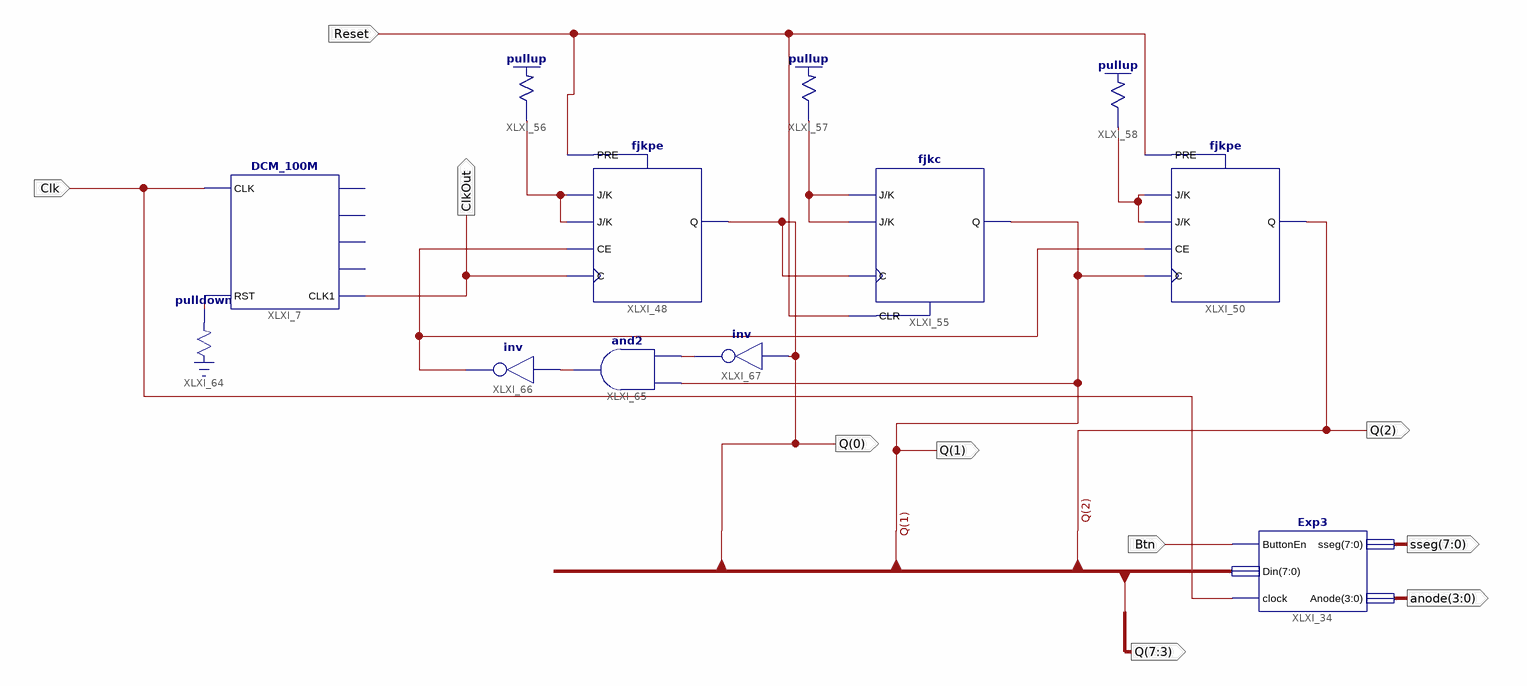
[diagram p0: schematic sheet 1]
// Xilinx ISE schematic Exp4JKOneShotCounter.sch (spartan3e) as structural Verilog: 12 symbols, 10 ports
module Exp4JKOneShotCounter (
  input  Btn,
  input  Reset,
  input  Clk,
  output [7:0] sseg,
  output [3:0] anode,
  output [7:0] Q,
  output ClkOut
);

  wire XLXN_74, XLXN_76, XLXN_112, XLXN_120, XLXN_121, XLXN_123, XLXN_129;

  Exp3 XLXI_34 (.ButtonEn(Btn), .Din(Q), .clock(Clk), .sseg(sseg), .Anode(anode));
  DCM_100M XLXI_7 (.CLK(Clk), .RST(XLXN_112), .CLK1(ClkOut));  // open: CLK1M, CLK10k, CLK1k, CLK100
  fjkpe XLXI_48 (.C(ClkOut), .CE(XLXN_120), .J(XLXN_74), .K(XLXN_74), .PRE(Reset), .Q(Q[0]));
  fjkpe XLXI_50 (.C(Q[1]), .CE(XLXN_120), .J(XLXN_76), .K(XLXN_76), .PRE(Reset), .Q(Q[2]));
  fjkc XLXI_55 (.C(Q[0]), .CLR(Reset), .J(XLXN_129), .K(XLXN_129), .Q(Q[1]));
  \pullup  XLXI_56 (.O(XLXN_74));
  \pullup  XLXI_57 (.O(XLXN_129));
  \pullup  XLXI_58 (.O(XLXN_76));
  \pulldown  XLXI_64 (.O(XLXN_112));
  and XLXI_65 (XLXN_121, XLXN_123, Q[1]);
  not XLXI_66 (XLXN_120, XLXN_121);
  not XLXI_67 (XLXN_123, Q[0]);
endmodule
